# EAGLE design fablab_example_board (EAGLE 8.7.1)
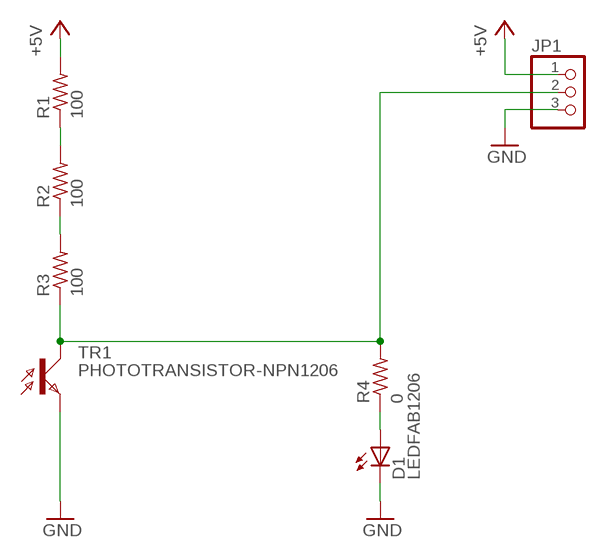
[diagram p0: schematic, sheet 1]

## Parts
D1  LEDFAB1206  [LED1206FAB]
JP1  PINHD-1X3  [1X03]
R1  100  RES-US1206FAB  [R1206FAB]
R2  100  RES-US1206FAB  [R1206FAB]
R3  100  RES-US1206FAB  [R1206FAB]
R4  0  RES-US1206FAB  [R1206FAB]
TR1  PHOTOTRANSISTOR-NPN1206  [OP1206]

## Nets
+5V: JP1.1 R1.2
GND: D1.2(C) JP1.3 TR1.E
N$1: R2.1 R3.2
N$2: R1.1 R2.2
N$3: JP1.2 R3.1 R4.2 TR1.C
N$4: D1.1(A) R4.1

## Library data of the parts
D1 = fab:LED: LED
JP1 = pinhead:PINHD-1X3: PIN HEADER
R1-R4 = fab:RES-US: Resistor (US Symbol) Variants with postfix FAB are widened to allow the routing of internal traces
TR1 = fab:PHOTOTRANSISTOR-NPN

## Board
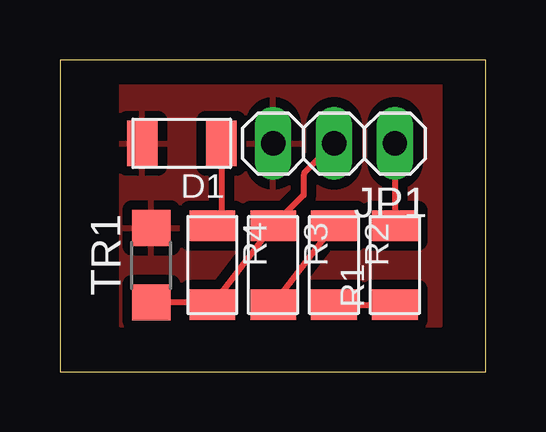
[diagram p1: board, top side]

Size 17.76 x 13.01 mm. Coordinates in mm from the lower left corner, seen from the top.
Outline: 0,0 17.76,0 17.76,13.01 0,13.01 0,0
Copper layers (1*16): Top 0.035mm / dielectric 1.5mm / Bottom 0.035mm
Design rules "default *": minimum track width 6mil, minimum drill 0.35mm, track to track 16mil, track to pad 16mil, pad to pad 16mil, via to via 6mil, smd to smd 16mil, copper to edge 40mil, drill to drill 6mil, minimum pad ring 10mil, minimum via ring 8mil, stop-mask expansion 4mil, vias tented up to drill 0mil, thermal gap 16mil

### Footprints (pad centres in the part's own frame; a part is rotated, then mirrored left to right if it is on the bottom)
LED1206FAB = smd 1.27 x 1.905: 1 -1.651,0; 2 1.651,0
1X03 = drill 1.016 long: 1 -2.54,0; 2 0,0; 3 2.54,0
R1206FAB = smd 1.27 x 1.905: 1 -1.651,0; 2 1.651,0
OP1206 = smd 1.5 x 1.6: C -1.55,0; E 1.55,0

### Placement (x,y rotation side)
D1  5.08,9.53 180 top
JP1  11.43,9.53 180 top
R1  13.97,4.45 90 top
R2  11.43,4.45 270 top
R3  8.89,4.45 270 top
R4  6.35,4.45 270 top
TR1  3.81,4.45 90 top

### Tracks (layer width: path | path; a pad name or v marks a point on that pad's centre or on a via)
+5V
  Top 0.254: JP1.1 R1.2
GND
  pour Top: 2.54,12.06 2.54,1.91 15.88,1.91 15.88,12.06
N$1
  Top 0.254: R3.2 R2.1
N$2
  Top 0.254: R2.2 R1.1
N$3
  Top 0.254: TR1.C 6.25,2.9 R4.2 R3.1 10.16,7.37 10.16,8.2 10.19,8.23 10.19,8.28 JP1.2
N$4
  Top 0.254: D1.1 6.73,6.48 R4.1

### Text on the board
_tNames: D1 | R4 | R2 | TR1 | R3 | R1 | JP1